# Altium schematic sheet МПСУ-46342.21-004 Э3 Лист3.SchDoc
size 297 x 209 mm; Разраб.: Муренков; Пров.: Приходько; Утв.: Приходько; Наименование организации: МПСУ; Наименование изделия 1: Приёмная ячейка; Наименование изделия 2: Схема электрическая; Наименование изделия 3: принципиальная; Нач. отд.: Нач. отд.; Фамилия нач. отд.: Лялин; Address1: Address1; Address2: Address2; Address3: Address3; Address4: Address4; SheetNumber: 3; Scale: 1:1; Обозначение документа: МПСУ-46342.21-004 Э3
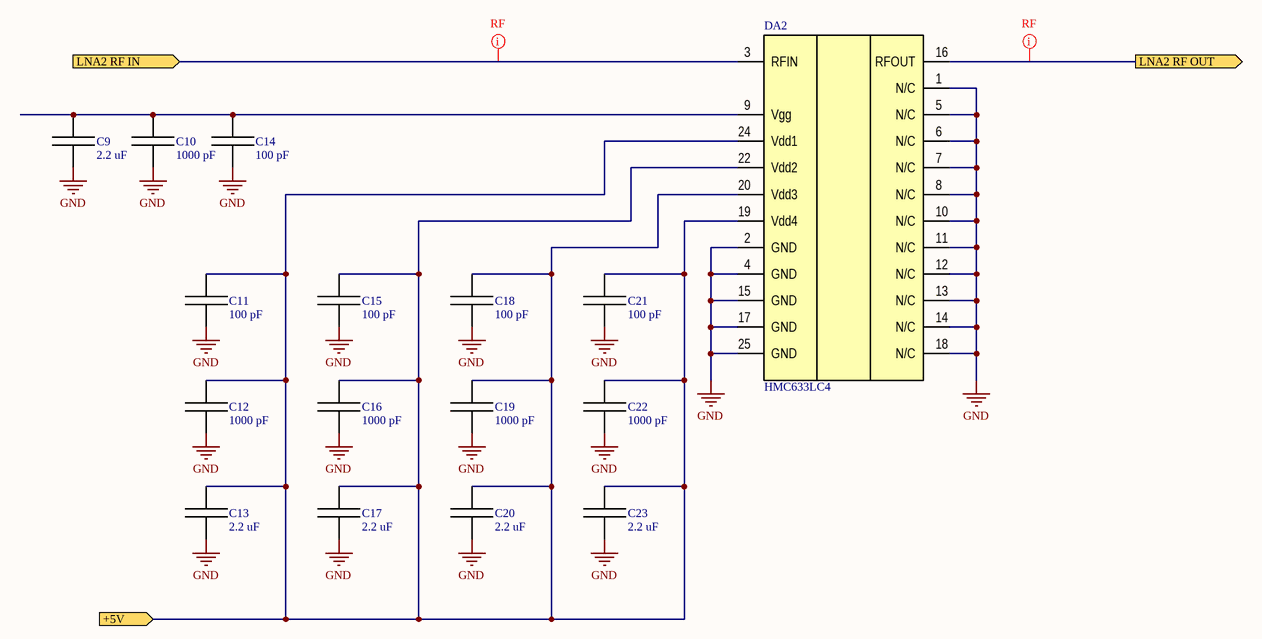
[diagram p0: МПСУ-46342.21-004 Э3 Лист3.SchDoc]

## Parts
C9  2.2 uF  [CAPC100X50X55L20N]
C10  1000 pF  [CAPC100X50X55L20N]
C11  100 pF  [CAPC100X50X55L20N]
C12  1000 pF  [CAPC100X50X55L20N]
C13  2.2 uF  [CAPC160X80X90L30N]
C14  100 pF  [CAPC100X50X55L20N]
C15  100 pF  [CAPC100X50X55L20N]
C16  1000 pF  [CAPC100X50X55L20N]
C17  2.2 uF  [CAPC160X80X90L30N]
C18  100 pF  [CAPC100X50X55L20N]
C19  1000 pF  [CAPC100X50X55L20N]
C20  2.2 uF  [CAPC160X80X90L30N]
C21  100 pF  [CAPC100X50X55L20N]
C22  1000 pF  [CAPC100X50X55L20N]
C23  2.2 uF  [CAPC160X80X90L30N]
DA2  HMC633LC4  [PQFN25P50_390X390X100L32X30T250N]

## Ports
+5V (in), LNA2 RF IN (in), LNA2 RF OUT (out)

## Nets
GND: C9.1 C10.1 C11.1 C12.1 C13.1 C14.1 C15.1 C16.1 C17.1 C18.1 C19.1 C20.1 C21.1 C22.1 C23.1 DA2.1(N/C) DA2.2(GND) DA2.4(GND) DA2.5(N/C) DA2.6(N/C) DA2.7(N/C) DA2.8(N/C) DA2.10(N/C) DA2.11(N/C) DA2.12(N/C) DA2.13(N/C) DA2.14(N/C) DA2.15(GND) DA2.17(GND) DA2.18(N/C) DA2.25(GND)
+5V: C11.2 C12.2 C13.2 C15.2 C16.2 C17.2 C18.2 C19.2 C20.2 C21.2 C22.2 C23.2 DA2.19(Vdd4) DA2.20(Vdd3) DA2.22(Vdd2) DA2.24(Vdd1) ; port +5V
LNA2 RF IN: DA2.3(RFIN) ; port LNA2 RF IN
LNA2 RF OUT: DA2.16(RFOUT) ; port LNA2 RF OUT
NetC9_2: C9.2 C10.2 C14.2 DA2.9(Vgg)

## Layout directives
net class RF: LNA2 RF IN, LNA2 RF OUT

## Notes on the sheet
- Подп. и дата
- Инв. № дубл.
- Взам. инв. №
- Инв. № подл.
- Изм.
- Лист
- № докум.
- Подп.
- Дата
- Копировал
- Формат А4

## Library data of the parts
C9-C23 = Capacitor: Capacitor, generic; Tolerance: 5 %; VDC: 20 V; PartNumber: *; Dielectric: *; Manufacturer: *
  C9: Value: 2.2 uF; Package: 0402
  C10 C12 C16 C19 C22: Value: 1000 pF; Package: 0402
  C11 C14 C15 C18 C21: Value: 100 pF; Package: 0402
  C13 C17 C20 C23: Value: 2.2 uF; Package: 0603
DA2 = HMC633LC4: GaAs, pHEMT MMIC DRIVERAMPLIFIER, 5.5 - 17 GHz; Manufacturer: Analog Devices; ComponentLink1Description: Component page; ComponentLink1URL: https://www.analog.com/en/products/hmc633lc4.html; PartNumber: HMC633LC4; ClassName: RFCons